# EAGLE board snesram (EAGLE 5.06), part 1 of 2
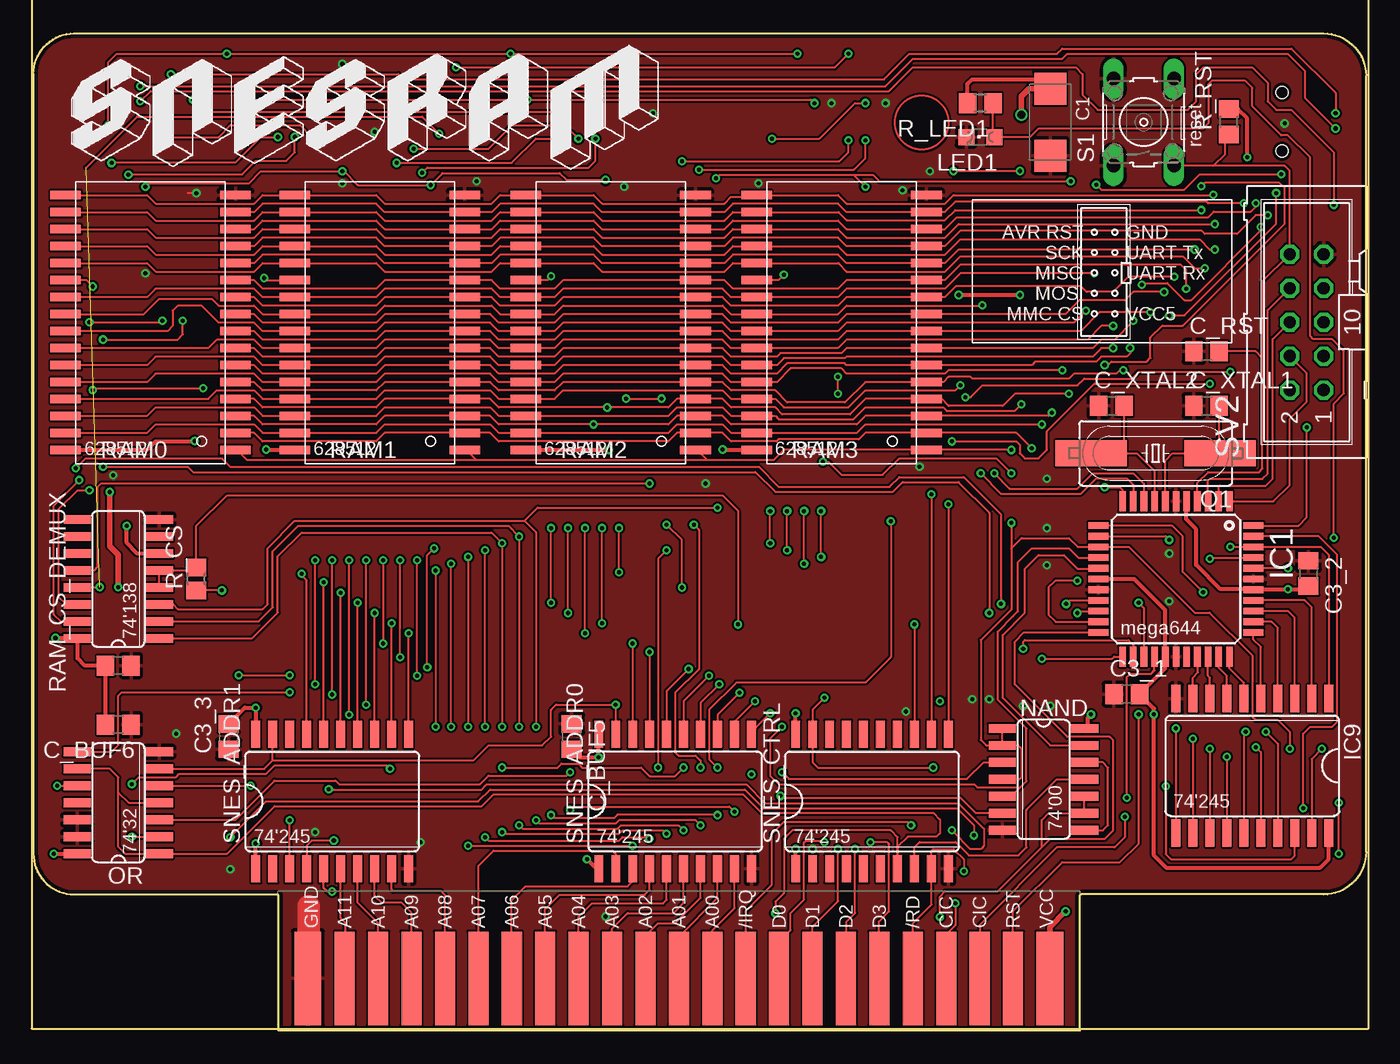
[diagram p2: board, top side]
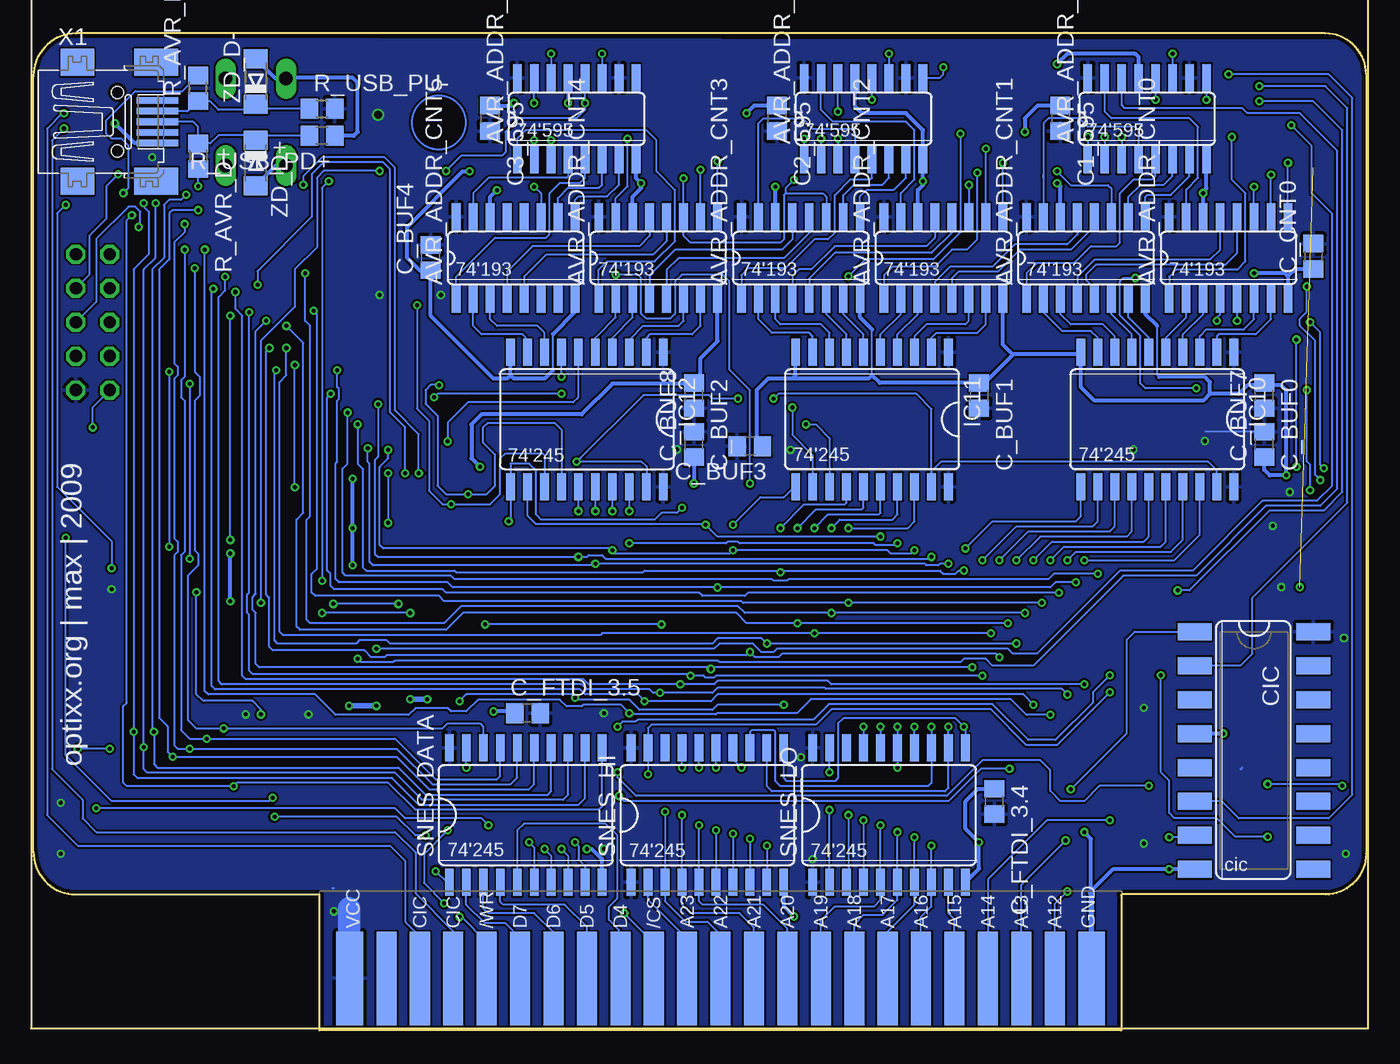
[diagram p3: board, bottom side, seen from below]

Size 99.7 x 74.55 mm. Coordinates in mm from the lower left corner, seen from the top.
Outline: 99.7,71.34 99.7,13.33 arc-90 96.52,10.16 78.36,10.16
Outline: 18.32,10.11 18.32,0 78.3,0 78.3,10.11
Outline: 18.29,10.16 3.05,10.16 arc-90 0,13.21 0,71.5 arc-90 3.05,74.55 96.52,74.55 arc-90 99.7,71.37
Copper layers (1*16): Top 0.035mm / dielectric 1.5mm / Bottom 0.035mm
Design rules "PropagandaPCB": minimum track width 6mil, minimum drill 10mil, track to track 6mil, track to pad 6mil, pad to pad 6mil, via to via 6mil, smd to smd 6mil, copper to edge 10mil, drill to drill 10mil, minimum pad ring 10mil, minimum via ring 6mil, stop-mask expansion 2mil, vias tented up to drill 100mil, thermal gap 10mil
Milling: 4 lines

## Footprints (pad centres in the part's own frame; a part is rotated, then mirrored left to right if it is on the bottom)
SO16 = smd 0.66 x 2.032: 1 -4.445,-3.073; 2 -3.175,-3.073; 3 -1.905,-3.073; 4 -0.635,-3.073; 5 0.635,-3.073; 6 1.905,-3.073; 7 3.175,-3.073; 8 4.445,-3.073; 9 4.445,3.073; 10 3.175,3.073; 11 1.905,3.073; 12 0.635,3.073; 13 -0.635,3.073; 14 -1.905,3.073; 15 -3.175,3.073; 16 -4.445,3.073
SMC_C = smd 2.4 x 2.4: + -2.5,0; - 2.5,0
C0805 = smd 1.3 x 1.5: 1 -0.95,0; 2 0.95,0
DIL16_SMD = smd 1.27 x 2.54: 1 -8.89,-4.445; 2 -6.35,-4.445; 3 -3.81,-4.445; 4 -1.27,-4.445; 5 1.27,-4.445; 6 3.81,-4.445; 7 6.35,-4.445; 8 8.89,-4.445; 9 8.89,4.445; 10 6.35,4.445; 11 3.81,4.445; 12 1.27,4.445; 13 -1.27,4.445; 14 -3.81,4.445; 15 -6.35,4.445; 16 -8.89,4.445
TQFP44 = smd 1.5 x 0.5: 1 -5.8,4; 2 -5.8,3.2; 3 -5.8,2.4; 4 -5.8,1.6; 5 -5.8,0.8; 6 -5.8,0; 7 -5.8,-0.8; 8 -5.8,-1.6; 9 -5.8,-2.4; 10 -5.8,-3.2; 11 -5.8,-4; 23 5.8,-4; 24 5.8,-3.2; 25 5.8,-2.4; 26 5.8,-1.6; 27 5.8,-0.8; 28 5.8,0; 29 5.8,0.8; 30 5.8,1.6; 31 5.8,2.4; 32 5.8,3.2; 33 5.8,4 | smd 0.5 x 1.5: 12 -4,-5.8; 13 -3.2,-5.8; 14 -2.4,-5.8; 15 -1.6,-5.8; 16 -0.8,-5.8; 17 0,-5.8; 18 0.8,-5.8; 19 1.6,-5.8; 20 2.4,-5.8; 21 3.2,-5.8; 22 4,-5.8; 34 4,5.8; 35 3.2,5.8; 36 2.4,5.8; 37 1.6,5.8; 38 0.8,5.8; 39 0,5.8; 40 -0.8,5.8; 41 -1.6,5.8; 42 -2.4,5.8; 43 -3.2,5.8; 44 -4,5.8
SO20W = smd 0.66 x 2.032: 1 -5.715,-5.029; 2 -4.445,-5.029; 3 -3.175,-5.029; 4 -1.905,-5.029; 5 -0.635,-5.029; 6 0.635,-5.029; 7 1.905,-5.029; 8 3.175,-5.029; 9 4.445,-5.029; 10 5.715,-5.029; 11 5.715,5.029; 12 4.445,5.029; 13 3.175,5.029; 14 1.905,5.029; 15 0.635,5.029; 16 -0.635,5.029; 17 -1.905,5.029; 18 -3.175,5.029; 19 -4.445,5.029; 20 -5.715,5.029
CHIPLED_0805 = smd 1.2 x 1.2: A 0,-1.05; C 0,1.05
SO14 = smd 0.66 x 2.032: 1 -3.81,-3.073; 2 -2.54,-3.073; 3 -1.27,-3.073; 4 0,-3.073; 5 1.27,-3.073; 6 2.54,-3.073; 7 3.81,-3.073; 8 3.81,3.073; 9 2.54,3.073; 10 1.27,3.073; 11 0,3.073; 12 -1.27,3.073; 13 -2.54,3.073; 14 -3.81,3.073
HC49UP = smd 5.334 x 1.93: 1 -4.826,0; 2 4.826,0
R0805 = smd 1.3 x 1.5: 1 -0.95,0; 2 0.95,0
R0805' = smd 1.3 x 1.5: 1 -0.85,0; 2 0.85,0
MEMORY-SAMSUNG-2_SOP-32 = smd 0.635 x 2.286: 1 -9.525,-6.35; 2 -8.255,-6.35; 3 -6.985,-6.35; 4 -5.715,-6.35; 5 -4.445,-6.35; 6 -3.175,-6.35; 7 -1.905,-6.35; 8 -0.635,-6.35; 9 0.635,-6.35; 10 1.905,-6.35; 11 3.175,-6.35; 12 4.445,-6.35; 13 5.715,-6.35; 14 6.985,-6.35; 15 8.255,-6.35; 16 9.525,-6.35; 17 9.525,6.35; 18 8.255,6.35; 19 6.985,6.35; 20 5.715,6.35; 21 4.445,6.35; 22 3.175,6.35; 23 1.905,6.35; 24 0.635,6.35; 25 -0.635,6.35; 26 -1.905,6.35; 27 -3.175,6.35; 28 -4.445,6.35; 29 -5.715,6.35; 30 -6.985,6.35; 31 -8.255,6.35; 32 -9.525,6.35
B3F-10XX = drill 1.016 long: 1 -3.251,2.261; 2 3.251,2.261; 3 -3.251,-2.261; 4 3.251,-2.261
ML10 = drill 0.914 octagon: 1 -5.08,-1.27; 2 -5.08,1.27; 3 -2.54,-1.27; 4 -2.54,1.27; 5 0,-1.27; 6 0,1.27; 7 2.54,-1.27; 8 2.54,1.27; 9 5.08,-1.27; 10 5.08,1.27
SNES_CON = smd 2 x 7: 5 2.25,3.5; 27 57.75,3.5 | smd 1.5 x 7: 6 5,3.5; 7 7.5,3.5; 8 10,3.5; 9 12.5,3.5; 10 15,3.5; 11 17.5,3.5; 12 20,3.5; 13 22.5,3.5; 14 25,3.5; 15 27.5,3.5; 16 30,3.5; 17 32.5,3.5; 18 35,3.5; 19 37.5,3.5; 20 40,3.5; 21 42.5,3.5; 22 45,3.5; 23 47.5,3.5; 24 50,3.5; 25 52.5,3.5; 26 55,3.5 | smd 2 x 7 bottom: 36 2.25,3.5; 58 57.75,3.5 | smd 1.5 x 7 bottom: 37 5,3.5; 38 7.5,3.5; 39 10,3.5; 40 12.5,3.5; 41 15,3.5; 42 17.5,3.5; 43 20,3.5; 44 22.5,3.5; 45 25,3.5; 46 27.5,3.5; 47 30,3.5; 48 32.5,3.5; 49 35,3.5; 50 37.5,3.5; 51 40,3.5; 52 42.5,3.5; 53 45,3.5; 54 47.5,3.5; 55 50,3.5; 56 52.5,3.5; 57 55,3.5
CON-CYPRESSINDUSTRIES_32005-201 = smd 0.5 x 3.1: 1 1.6,-9.027; 2 0.8,-9.027; 3 0,-9.027; 4 -0.8,-9.027; 5 -1.6,-9.027 | smd 2 x 2.5: M1 -4.45,-3.027; M2 4.45,-3.027 | smd 2 x 3.3: M3 4.45,-8.928; M4 -4.45,-8.928 | hole 0.9: 2.2,-6.027; -2.2,-6.027
MINIMELF = smd 1.4 x 1.8: A 1.7,0; C -1.7,0

## Placement (x,y rotation side)
AVR_ADDR_CNT0  40193D  [SO16]  10.29,57.77 0 bottom
AVR_ADDR_CNT1  40193D  [SO16]  20.96,57.75 0 bottom
AVR_ADDR_CNT2  40193D  [SO16]  31.62,57.75 0 bottom
AVR_ADDR_CNT3  40193D  [SO16]  42.29,57.75 0 bottom
AVR_ADDR_CNT4  40193D  [SO16]  52.96,57.75 0 bottom
AVR_ADDR_CNT5  40193D  [SO16]  63.63,57.75 0 bottom
AVR_ADDR_SREG0  74HCT595D  [SO16]  16.38,68.17 0 bottom
AVR_ADDR_SREG1  74HCT595D  [SO16]  37.59,68.17 0 bottom
AVR_ADDR_SREG2  74HCT595D  [SO16]  59.05,68.17 0 bottom
C1  [SMC_C]  76.07,67.91 270 top
C1_595  100n  [C0805]  22.86,68.2 270 bottom
C2_595  100n  [C0805]  44.07,68.2 270 bottom
C3_1  100n  [C0805]  81.79,25.15 0 top
C3_2  100n  [C0805]  95.38,34.16 270 top
C3_3  100n  [C0805]  14.6,21.97 90 top
C3_595  100n  [C0805]  65.53,68.2 270 bottom
C_BUF0  100n  [C0805]  7.62,47.47 270 bottom
C_BUF1  100n  [C0805]  28.96,47.47 270 bottom
C_BUF2  100n  [C0805]  50.29,47.47 270 bottom
C_BUF3  100n  [C0805]  46.1,43.69 180 bottom
C_BUF4  100n  [C0805]  69.98,57.78 90 bottom
C_BUF5  100n  [C0805]  40.26,21.97 270 top
C_BUF6  100n  [C0805]  6.35,22.86 180 top
C_BUF7  100n  [C0805]  7.62,43.81 90 bottom
C_BUF8  100n  [C0805]  50.29,43.81 90 bottom
C_CNT0  100n  [C0805]  3.94,57.88 90 bottom
C_DEMUX  100n  [C0805]  6.35,27.27 180 top
C_FTDI_3.4  100n  [C0805]  27.81,17.11 270 bottom
C_FTDI_3.5  100n  [C0805]  62.74,23.72 0 bottom
C_RST  47n  [C0805]  87.76,50.77 0 top
C_XTAL1  22p  [C0805]  87.76,46.7 0 top
C_XTAL2  22p  [C0805]  80.65,46.7 0 top
CIC  DIL16_SMD  [DIL16_SMD]  8.38,20.92 270 bottom
IC1  ATMEGA644A  [TQFP44]  85.47,33.75 270 top
IC9  74LS245DW  [SO20W]  91.19,19.78 180 top
IC10  74LS245DW  [SO20W]  15.62,45.69 180 bottom
IC11  74LS245DW  [SO20W]  36.96,45.69 180 bottom
IC12  74LS245DW  [SO20W]  58.29,45.69 180 bottom
LED1  2-4mA  [CHIPLED_0805]  70.83,66.8 90 top
NAND  74S00D  [SO14]  75.56,18.76 270 top
OR  74HC32D  [SO14]  6.35,17.02 90 top
Q1  20MHz  [HC49UP]  83.95,43.15 180 top
R_AVR_D+  68  [R0805]  87.38,65.37 270 bottom
R_AVR_D-  68  [R0805]  87.38,70.45 90 bottom
R_CS  200  [R0805']  12.19,33.75 90 top
R_LED1  1k6  [R0805]  70.83,69.34 180 top
R_RST  4k7  [R0805]  89.44,67.94 90 top
R_USB_PD+  1M  [R0805]  78.11,66.9 180 bottom
R_USB_PU-  1k5  [R0805]  78.11,68.93 0 bottom
RAM0  KM628512-XX  [MEMORY-SAMSUNG-2_SOP-32]  8.76,52.93 90 top
RAM1  KM628512-XX  [MEMORY-SAMSUNG-2_SOP-32]  25.91,52.93 90 top
RAM2  KM628512-XX  [MEMORY-SAMSUNG-2_SOP-32]  43.18,52.93 90 top
RAM3  KM628512-XX  [MEMORY-SAMSUNG-2_SOP-32]  60.45,52.93 90 top
RAM_CS_DEMUX  74LS138D  [SO16]  6.35,33.75 90 top
S1  [B3F-10XX]  83.06,67.91 90 top
SNES_ADDR0  74LS245DW  [SO20W]  48.01,17.11 0 top
SNES_ADDR1  74LS245DW  [SO20W]  22.35,17.11 0 top
SNES_CTRL  74LS245DW  [SO20W]  62.74,17.11 0 top
SNES_DATA  74LS245DW  [SO20W]  62.86,16.1 0 bottom
SNES_HI  74LS245DW  [SO20W]  49.28,16.1 0 bottom
SNES_LO  74LS245DW  [SO20W]  35.69,16.1 0 bottom
SV2  [ML10]  95.25,52.96 90 top
U$3  SNES_CON_FRONT  [SNES_CON]  18.29,0.38 0 top
X1  MINI-USB  [CON-CYPRESSINDUSTRIES_32005-201]  99.44,67.94 90 bottom
ZD_D+  3.6V  [MINIMELF]  83.06,64.86 270 bottom
ZD_D-  3.6V  [MINIMELF]  83.06,70.96 90 bottom

## Tracks (layer width: path | path; a pad name or v marks a point on that pad's centre or on a via)
A0  (via drill 0.3, 0.3 pad 0.61)
  Top 0.152: v86.87,58.39 69.22,58.39 68.2,57.37 RAM3.12 60.83,57.37 60.2,58.01 52.32,58.01 51.69,57.37 RAM2.12 42.54,57.37 41.91,58.01 34.92,58.01 34.29,57.37 RAM1.12 26.29,57.37 25.65,58.01 17.14,58.01 16.51,57.37 RAM0.12 | v23.62,23.59 v23.62,35.15 | SNES_ADDR0.11 53.72,22.32 v55.12,23.72
  Bottom 0.152: v86.87,58.39 86.87,25.37 86.61,25.11 78.61,25.11 77.09,23.59 71.63,23.59 71.12,24.1 68.71,24.1 68.45,23.84 67.31,23.84 66.42,24.73 60.32,24.73 59.82,24.22 58.67,24.22 58.55,24.35 55.75,24.35 v55.12,23.72 55.02,23.62 48.64,23.62 48.55,23.72 42.58,23.72 41.53,24.76 26.58,24.76 25.4,23.59 v23.62,23.59 | IC10.16 14.99,36.54 15.37,36.16 22.61,36.16 v23.62,35.15
A1  (via drill 0.3, 0.3 pad 0.61)
  Top 0.152: v86.23,55.47 86.23,56.86 85.85,57.24 69.34,57.24 68.2,56.1 RAM3.11 60.83,56.1 60.2,55.47 52.32,55.47 51.69,56.1 RAM2.11 39.62,56.1 38.99,55.47 34.92,55.47 34.29,56.1 RAM1.11 26.29,56.1 25.65,55.47 17.14,55.47 16.51,56.1 RAM0.11 | v24.89,24.35 v24.89,35.15 | SNES_ADDR0.12 52.45,23.08 v53.97,24.61
  Bottom 0.152: v86.23,55.47 86.36,55.34 86.36,25.75 86.11,25.49 58.8,25.49 58.42,25.11 54.48,25.11 v53.97,24.61 49.02,24.61 48.51,25.11 25.65,25.11 v24.89,24.35 | IC10.15 16.26,36.92 16.64,36.54 23.5,36.54 v24.89,35.15
A2  (via drill 0.3, 0.3 pad 0.61)
  Top 0.152: v85.34,56.36 81.92,56.36 80.77,55.21 78.77,55.21 78.36,55.63 68.99,55.63 68.2,54.83 RAM3.10 60.83,54.83 60.2,54.2 52.2,54.2 51.56,54.83 RAM2.10 39.62,54.83 38.99,54.2 34.92,54.2 34.29,54.83 RAM1.10 26.29,54.83 25.65,54.2 17.14,54.2 16.51,54.83 RAM0.10 | v22.35,25.11 v22.35,35.15 | SNES_ADDR0.13 51.18,23.59 v52.83,25.24
  Bottom 0.152: v85.34,56.36 85.34,55.34 85.85,54.83 85.85,26.13 85.6,25.88 58.67,25.88 58.29,25.49 53.59,25.49 53.34,25.24 v52.83,25.24 48.89,25.24 48.51,25.62 40.51,25.62 40.42,25.53 22.77,25.53 v22.35,25.11 | IC10.17 13.72,36.67 14.6,35.78 21.72,35.78 v22.35,35.15
A3  (via drill 0.3, 0.3 pad 0.61)
  Top 0.152: v84.58,55.21 82.3,55.21 81.66,54.58 78.23,54.58 77.22,53.56 RAM3.9 60.83,53.56 60.2,52.93 52.2,52.93 51.56,53.56 RAM2.9 39.62,53.56 38.99,52.93 34.8,52.93 34.16,53.56 RAM1.9 26.29,53.56 25.65,52.93 17.14,52.93 16.51,53.56 RAM0.9 | v21.08,25.88 v21.08,35.15 | SNES_ADDR0.14 49.91,24.48 v51.31,25.88
  Bottom 0.152: v84.58,55.21 84.58,53.94 84.07,53.43 84.07,26.51 83.82,26.26 58.55,26.26 58.17,25.88 v51.31,25.88 48.77,25.88 48.51,26.13 40.26,26.13 40,25.88 v21.08,25.88 | v21.08,35.15 14.35,35.15 12.45,37.05 IC10.18
A4  (via drill 0.3, 0.3 pad 0.61)
  Top 0.152: v83.57,53.69 79.76,53.69 78.36,52.29 RAM3.8 60.83,52.29 60.2,51.66 52.2,51.66 51.56,52.29 RAM2.8 39.62,52.29 38.99,51.66 34.8,51.66 34.16,52.29 RAM1.8 26.29,52.29 25.65,51.66 17.14,51.66 16.51,52.29 RAM0.8 | v28.7,26.51 v28.7,35.15 | 50.42,26.51 v50.55,26.51 48.64,24.61 SNES_ADDR0.15
  Bottom 0.152: 83.57,53.82 v83.57,53.69 83.57,32.73 83.69,32.61 83.69,31.21 83.57,31.08 83.57,26.89 83.31,26.64 50.67,26.64 v50.55,26.51 49.53,26.51 49.4,26.38 48.77,26.38 48.64,26.51 v28.7,26.51 | IC10.12 20.07,38.07 20.45,37.69 26.16,37.69 v28.7,35.15
A5  (via drill 0.3, 0.3 pad 0.61)
  Top 0.152: v82.3,53.05 80.9,51.66 79.88,51.66 79.25,51.02 RAM3.7 60.83,51.02 60.45,50.64 55.88,50.64 55.63,50.39 52.2,50.39 51.56,51.02 RAM2.7 39.62,51.02 38.99,50.39 34.8,50.39 34.16,51.02 RAM1.7 26.29,51.02 25.65,50.39 17.14,50.39 16.51,51.02 RAM0.7 | v29.97,36.04 29.46,35.53 v29.46,27.15 | SNES_ADDR0.16 47.37,25.37 v49.02,27.02
  Bottom 0.152: v29.46,27.15 48.89,27.15 v49.02,27.02 49.02,27.15 82.8,27.15 83.06,27.4 83.06,31.21 83.31,31.46 83.31,32.38 83.06,32.64 83.06,52.29 v82.3,53.05 | IC10.11 21.34,38.45 21.72,38.07 27.94,38.07 v29.97,36.04
A6  (via drill 0.3, 0.3 pad 0.61)
  Top 0.152: v82.04,51.02 82.04,50.64 81.79,50.39 79.88,50.39 79.5,50.01 74.93,50.01 74.68,49.75 RAM3.6 60.83,49.75 60.71,49.88 56.39,49.88 55.63,49.12 52.2,49.12 51.56,49.75 RAM2.6 39.62,49.75 38.99,49.12 34.8,49.12 34.16,49.75 RAM1.6 26.29,49.75 25.65,49.12 17.14,49.12 16.51,49.75 RAM0.6 | v27.43,27.91 v27.43,35.15 | v46.1,28.29 SNES_ADDR0.17
  Bottom 0.152: v82.04,51.02 82.3,50.77 82.3,32.61 82.04,32.35 82.04,28.67 81.79,28.42 74.93,28.42 74.42,27.91 73.41,27.91 73.28,28.03 46.35,28.03 v46.1,28.29 45.72,27.91 43.94,27.91 43.69,28.16 27.69,28.16 v27.43,27.91 | IC10.13 18.8,37.69 19.18,37.31 25.27,37.31 v27.43,35.15
A7  (via drill 0.3, 0.3 pad 0.61)
  Top 0.152: v26.16,35.15 v26.16,28.92 | v81.53,49.37 81.28,49.37 81.03,49.12 77.85,49.12 77.47,48.74 70.23,48.74 70.1,48.86 68.45,48.86 68.07,48.48 RAM3.5 62.23,48.48 60.71,46.96 56.39,46.96 55.5,47.85 52.2,47.85 51.56,48.48 RAM2.5 39.62,48.48 38.99,47.85 34.8,47.85 34.16,48.48 RAM1.5 26.29,48.48 25.65,47.85 17.14,47.85 16.51,48.48 RAM0.5 | v44.83,28.92 SNES_ADDR0.18
  Bottom 0.152: v81.53,49.37 81.66,49.24 81.66,29.18 81.41,28.92 75.56,28.92 75.31,29.18 73.28,29.18 73.03,28.92 48.89,28.92 48.51,29.3 45.21,29.3 v44.83,28.92 v26.16,28.92 | IC10.14 17.53,37.31 17.91,36.92 24.38,36.92 v26.16,35.15
A8  (via drill 0.3, 0.3 pad 0.61)
  Top 0.152: v80.77,51.02 79.88,51.02 79.25,50.39 60.83,50.39 60.71,50.26 56.13,50.26 55.63,49.75 RAM3.27 52.2,49.75 51.56,50.39 39.62,50.39 38.99,49.75 RAM2.27 34.8,49.75 34.16,50.39 26.29,50.39 25.65,49.75 RAM1.27 17.14,49.75 16.51,50.39 9.14,50.39 8.51,49.75 RAM0.27 | v41.27,29.69 v41.27,37.56 | SNES_ADDR1.11 v28.07,29.69
  Bottom 0.152: v80.77,51.02 80.77,48.99 81.28,48.48 81.28,29.81 81.03,29.56 57.28,29.56 57.15,29.69 v41.27,29.69 v28.07,29.69 | IC11.16 36.32,38.7 36.45,38.58 40.26,38.58 v41.27,37.56
A9  (via drill 0.3, 0.3 pad 0.61)
  Top 0.152: v42.54,30.45 v42.54,37.56 | SNES_ADDR1.12 v26.8,30.45 | RAM0.26 13.08,51.02 13.72,51.66 16.51,51.66 17.14,51.02 RAM1.26 25.65,51.02 26.29,51.66 34.16,51.66 34.8,51.02 RAM2.26 38.99,51.02 39.62,51.66 51.56,51.66 52.2,51.02 RAM3.26 60.2,51.02 60.83,51.66 78.87,51.66 79.88,52.67 v80.77,52.67
  Bottom 0.152: v80.77,52.67 79.5,51.4 79.5,38.7 80.01,38.19 80.01,30.19 79.76,29.94 68.83,29.94 67.56,31.21 47.12,31.21 46.35,30.45 v42.54,30.45 v26.8,30.45 | IC11.15 37.59,39.08 37.72,38.96 41.15,38.96 v42.54,37.56
A10  (via drill 0.3, 0.3 pad 0.61)
  Top 0.152: v79.38,56.61 69.34,56.61 68.2,55.47 60.83,55.47 60.2,54.83 RAM3.23 52.2,54.83 51.56,55.47 39.62,55.47 38.99,54.83 RAM2.23 34.92,54.83 34.29,55.47 26.29,55.47 25.65,54.83 RAM1.23 17.14,54.83 16.51,55.47 9.14,55.47 8.51,54.83 RAM0.23 | v40,31.21 v40,37.56 | SNES_ADDR1.13 v25.53,31.21
  Bottom 0.152: v79.38,56.61 79.38,53.05 78.99,52.67 78.99,38.45 79.25,38.19 79.25,30.7 78.99,30.45 68.96,30.45 67.69,31.72 46.99,31.72 46.48,31.21 v40,31.21 v25.53,31.21 | IC11.17 35.05,38.58 35.43,38.19 39.37,38.19 v40,37.56
A11  (via drill 0.3, 0.3 pad 0.61)
  Top 0.152: v78.74,53.82 77.85,52.93 60.83,52.93 60.2,52.29 RAM3.25 52.2,52.29 51.56,52.93 39.62,52.93 38.99,52.29 RAM2.25 34.8,52.29 34.16,52.93 26.29,52.93 25.65,52.29 RAM1.25 17.14,52.29 16.51,52.93 13.84,52.93 12.57,54.2 10.79,54.2 10.41,53.82 10.41,52.67 10.03,52.29 RAM0.25 | v38.73,31.97 v38.73,37.56 | SNES_ADDR1.14 v24.26,31.97
  Bottom 0.152: v78.74,53.82 78.49,53.56 78.49,34.51 78.87,34.13 78.87,32.73 78.61,32.48 69.34,32.48 68.96,32.1 46.74,32.1 46.61,31.97 v38.73,31.97 v24.26,31.97 | v38.73,37.56 34.29,37.56 33.78,38.07 IC11.18
A12  (via drill 0.3, 0.3 pad 0.61)
  Top 0.152: v77.47,47.59 73.41,47.59 72.52,46.7 68.45,46.7 67.95,47.21 RAM3.4 62.23,47.21 61.09,46.07 56.01,46.07 55.5,46.58 52.2,46.58 51.56,47.21 RAM2.4 48.13,47.21 47.5,46.58 v42.93,46.58 34.8,46.58 34.16,47.21 RAM1.4 26.29,47.21 25.65,46.58 17.14,46.58 16.51,47.21 RAM0.4 | SNES_ADDR1.15 v22.99,32.73
  Bottom 0.152: v77.47,47.59 77.72,47.34 77.72,34.38 77.47,34.13 77.47,33.24 77.22,32.99 69.09,32.99 68.83,32.73 49.91,32.73 49.66,32.48 46.48,32.48 46.23,32.73 v22.99,32.73 | v42.93,46.58 42.93,44.54 41.4,43.02 IC11.12
A13  (via drill 0.3, 0.3 pad 0.61)
  Top 0.152: v76.96,49.37 68.45,49.37 68.2,49.12 60.83,49.12 60.45,49.5 56.64,49.5 55.63,48.48 RAM3.28 52.2,48.48 51.56,49.12 39.62,49.12 38.99,48.48 RAM2.28 34.8,48.48 34.16,49.12 26.29,49.12 25.65,48.48 RAM1.28 17.14,48.48 16.51,49.12 9.14,49.12 8.51,48.48 RAM0.28 | v47.37,37.81 48.51,36.67 v48.51,33.11 | SNES_ADDR1.16 v21.72,33.5
  Bottom 0.152: v76.96,49.37 76.96,48.1 76.84,47.97 76.84,47.21 76.96,47.08 76.96,42.51 77.09,42.39 77.09,33.75 76.84,33.5 68.71,33.5 68.33,33.11 v48.51,33.11 23.62,33.11 23.24,33.5 v21.72,33.5 | v47.37,37.81 45.31,39.88 43.56,39.88 42.78,40.66 IC11.11
A14  (via drill 0.3, 0.3 pad 0.61)
  Top 0.152: SNES_ADDR1.17 20.45,33.65 20.07,34.04 v20.07,34.13 | RAM0.3 16.51,45.94 17.14,45.31 25.65,45.31 26.29,45.94 RAM1.3 34.16,45.94 34.8,45.31 v41.91,45.31 47.5,45.31 48.13,45.94 RAM2.3 51.56,45.94 52.2,45.31 61.59,45.31 62.23,45.94 RAM3.3 75.95,45.94 v76.2,46.2
  Bottom 0.152: v76.2,46.2 76.2,42.39 76.58,42 76.58,34.26 76.33,34 68.45,34 68.2,33.75 44.45,33.75 44.32,33.62 43.31,33.62 43.18,33.75 23.75,33.75 23.37,34.13 v20.07,34.13 | IC11.13 40.13,44.29 41.15,45.31 v41.91,45.31
A15  (via drill 0.3, 0.3 pad 0.61)
  Top 0.152: v75.44,45.31 62.23,45.31 61.59,44.67 RAM3.31 52.2,44.67 51.56,45.31 48.13,45.31 47.5,44.67 RAM2.31 34.8,44.67 34.16,45.31 26.29,45.31 25.65,44.67 RAM1.31 17.14,44.67 16.51,45.31 9.14,45.31 8.51,44.67 RAM0.31 | v30.1,34.38 v30.1,22.7 | v43.81,34.26 v43.81,37.56
  Bottom 0.152: v75.44,45.31 75.44,42.39 75.06,42 75.06,34.64 74.8,34.38 68.2,34.38 68.07,34.26 54.1,34.26 53.97,34.38 43.94,34.38 v43.81,34.26 43.69,34.38 31.88,34.38 31.62,34.13 30.73,34.13 30.48,34.38 v30.1,34.38 | IC11.14 38.86,39.46 38.99,39.34 42.04,39.34 v43.81,37.56 | SNES_LO.11 29.97,22.57 v30.1,22.7 30.73,23.34 39.12,23.34 39.5,22.95 39.5,18.89 39.75,18.64 43.31,18.64 43.56,18.89 SNES_HI.11
A16  (via drill 0.3, 0.3 pad 0.61)
  Top 0.152: v74.68,43.53 73.53,44.67 RAM3.2 62.23,44.67 61.75,44.2 55.75,44.2 55.59,44.04 52.2,44.04 51.56,44.67 RAM2.2 48.13,44.67 47.5,44.04 34.8,44.04 34.16,44.67 RAM1.2 26.29,44.67 25.65,44.04 17.14,44.04 16.51,44.67 RAM0.2 | v31.24,22.7 v31.24,34.89 | v57.66,34.89 v57.66,38.83
  Bottom 0.152: v74.68,43.53 74.68,42.51 74.55,42.39 74.55,35.02 74.3,34.77 57.78,34.77 v57.66,34.89 33.02,34.89 32.89,34.77 32,34.77 31.88,34.89 v31.24,34.89 | v57.66,38.83 IC12.16 | v31.24,22.7 SNES_LO.12 31.24,18.13 31.5,17.87 44.45,17.87 44.83,18.26 SNES_HI.12
A17  (via drill 0.3, 0.3 pad 0.61)
  Top 0.152: v73.91,46.83 73.41,46.32 68.33,46.32 68.07,46.58 62.23,46.58 61.34,45.69 55.75,45.69 55.5,45.94 RAM3.30 52.2,45.94 51.56,46.58 48.13,46.58 47.5,45.94 RAM2.30 34.8,45.94 34.16,46.58 26.29,46.58 25.65,45.94 RAM1.30 17.14,45.94 16.51,46.58 9.14,46.58 8.51,45.94 RAM0.30 | v32.51,35.4 v32.51,22.7 | v58.93,35.4 v58.93,38.83
  Bottom 0.152: v73.91,46.83 73.91,42.89 74.17,42.64 74.17,35.65 73.91,35.4 v58.93,35.4 58.29,35.4 58.17,35.53 57.15,35.53 56.9,35.27 32.64,35.27 v32.51,35.4 | v58.93,38.83 IC12.15 | v32.51,22.7 SNES_LO.13 32.51,18.51 32.77,18.26 43.81,18.26 44.2,18.64 44.2,22.32 44.32,22.45 45.97,22.45 46.1,22.32 SNES_HI.13
A18  (via drill 0.3, 0.3 pad 0.61)
  Top 0.152: 50.42,42.64 33.15,42.64 | 33.15,42.64 16,42.64 15.24,43.4 RAM0.1 | 50.42,42.64 55.37,42.64 56.13,43.4 RAM3.1 v73.15,43.4 | 50.42,42.64 49.66,43.4 RAM2.1 | 33.15,42.64 32.38,43.4 RAM1.1 | v33.78,22.7 v33.78,35.91 | v56.39,35.91 v56.39,38.83 | v47.37,35.91 46.74,35.27 v46.74,19.65
  Bottom 0.152: v33.78,35.91 34.04,35.65 35.56,35.65 35.81,35.91 v47.37,35.91 47.62,35.65 56.26,35.65 56.39,35.78 v56.39,35.91 56.52,36.04 73.53,36.04 73.79,36.29 73.79,42.13 73.15,42.77 v73.15,43.4 | v56.39,38.83 IC12.17 | SNES_LO.14 v33.78,22.7 | v46.74,19.65 47.37,20.29 SNES_HI.14
A19  (via drill 0.3, 0.3 pad 0.61)
  Top 0.152: v35.05,22.7 v35.05,36.42 34.26,37.21 20.07,37.21 18.29,35.43 18.29,31.24 16.35,29.3 RAM_CS_DEMUX.1 | v55.12,36.42 v55.12,38.83 | v48.64,19.65 48.01,19.02 46.1,19.02 45.47,19.65 41.05,19.65 40.77,19.94 39.5,19.94 39.21,19.65 v35.05,19.65
  Bottom 0.152: v35.05,36.42 35.18,36.29 36.7,36.29 36.83,36.42 46.86,36.42 46.99,36.54 47.75,36.54 47.88,36.42 v55.12,36.42 | v55.12,38.83 IC12.18 | v35.05,22.7 SNES_LO.15 v35.05,19.65 | v48.64,19.65 SNES_HI.15
A20  (via drill 0.3, 0.3 pad 0.61)
  Top 0.152: v36.32,22.7 v36.32,36.92 35.53,37.72 19.81,37.72 17.91,35.81 17.91,31.62 16.86,30.57 RAM_CS_DEMUX.2 | v49.91,19.65 49.91,20.16 49.53,20.54 48.26,20.54 48.01,20.8 48.01,25.24 49.78,27.02 49.78,37.43 v49.4,37.81
  Bottom 0.152: v36.32,36.92 48.51,36.92 v49.4,37.81 49.43,37.85 62.1,37.85 62.74,38.48 IC12.12 | v36.32,22.7 SNES_LO.16 | v49.91,19.65 SNES_HI.16
A21  (via drill 0.3)
  Top 0.152: v51.18,19.65 50.55,20.29 50.55,23.97 52.58,26 62.23,26 64.14,27.91 v64.14,38.07 | 36.73,38.1 19.56,38.1 17.53,36.07 17.53,31.88 17.14,31.5 10.79,31.5 10.45,31.84 RAM_CS_DEMUX.3 | 36.73,38.1 37.72,39.08 v51.18,39.08 | v37.59,22.7 37.59,37.24 36.73,38.1
  Bottom 0.152: v51.18,39.08 51.56,38.7 52.7,38.7 53.21,38.19 61.72,38.19 62.1,38.58 62.1,41.88 62.61,42.39 64.01,42.39 IC12.11 64.01,38.19 v64.14,38.07 | v37.59,22.7 SNES_LO.17 | v51.18,19.65 SNES_HI.17
AVR/SNES_SW  (via drill 0.3, 0.3 pad 0.3)
  Top 0.152: v93.98,21.05 93.98,22.32 93.09,23.21 91.44,23.21 91.19,23.46 91.19,28.03 87.98,31.24 86.87,31.24 81.96,36.15 IC1.14 78.12,36.15 77.47,36.8 73.91,36.8 73.15,36.04 | v96.39,21.05 95.63,20.29 IC9.19 | 73.15,36.04 73.15,31.46 70.87,29.18 70.87,21.72 71.28,21.3 NAND.2 | v73.15,37.94 73.15,36.04 | v44.32,47.24 v46.99,47.24 | v73.15,41.66 72.04,42.77 64.77,42.77 63.53,41.53 60.45,41.53 59.47,42.51 v59.05,42.51 | NAND.2 NAND.1 | NAND.4 73.76,18.76 73.91,18.92 73.91,21.08 73.66,21.34 72.52,21.34 NAND.2
  Bottom 0.152: v93.98,21.05 v96.39,21.05 | IC10.19 11.18,41.88 11.81,42.51 31.81,42.51 32.51,41.81 32.51,41.27 | 32.51,41.78 32.51,41.88 | 32.51,41.27 IC11.19 | 32.51,41.27 32.51,41.78 | 32.51,41.78 32.51,46.45 33.65,47.59 43.97,47.59 v44.32,47.24 | v59.05,42.51 58.8,42.77 | v73.15,41.66 v73.15,37.94 | v46.99,47.24 48.89,47.24 49.15,47.5 54.07,47.5 v59.05,42.51 | IC12.19 53.85,42.16 54.23,42.54 59.02,42.54 v59.05,42.51
AVR/SNES_SW_INV  (via drill 0.3)
  Top 0.152: SNES_ADDR0.19 v43.56,24.35 39.12,24.35 38.73,23.97 38.73,21.97 38.07,21.3 34.04,21.3 32.92,20.19 17.91,20.19 | v59.18,24.86 58.29,23.97 SNES_CTRL.19 58.29,20.03 58.67,19.65 v67.31,19.65 | OR.6 17.27,19.56 17.91,20.19 | 17.91,20.19 SNES_ADDR1.19
  Bottom 0.152: v67.82,24.61 67.31,25.11 59.44,25.11 v59.18,24.86 59.05,24.73 55.12,24.73 54.36,23.97 48.89,23.97 48.51,24.35 v43.56,24.35 | v67.31,19.65 SNES_DATA.19
AVR_ADDR_DWN  (via drill 0.3)
  Top 0.152: IC1.20 78.25,31.35 v78.11,31.21 | v71.5,31.21 71.5,38.7 69.22,40.99 65.02,40.99 64.29,40.26 55.5,40.26 54.01,41.75 11.94,41.75 11.56,42.13 v5.21,42.13 | v11.18,53.05 11.18,52.04 10.79,51.66 v5.21,51.66
  Bottom 0.152: v11.18,53.05 11.18,53.31 10.92,53.56 AVR_ADDR_CNT0.4 | v5.21,42.13 v5.21,51.66 | v71.5,31.21 v78.11,31.21
AVR_ADDR_LATCH  (via drill 0.3, 0.3 pad 0.3)
  Top 0.152: IC1.25 83.07,31.58 v82.68,31.97 | v15.75,69.6 v36.96,69.6 58.17,69.6 v58.42,69.34 | v68.83,64.26 v73.79,64.26
  Bottom 0.152: AVR_ADDR_SREG2.12 v58.42,69.34 58.42,68.83 59.05,68.2 63.37,68.2 64.39,67.18 64.39,65.66 64.64,65.4 67.69,65.4 v68.83,64.26 | AVR_ADDR_SREG0.12 v15.75,69.6 | v36.96,69.6 AVR_ADDR_SREG1.12 | v82.68,31.97 82.68,51.56 80.14,54.1 80.14,56.9 78.49,58.55 78.49,63.75 77.98,64.26 v73.79,64.26
AVR_ADDR_LOAD  (via drill 0.3)
  Top 0.152: v8.38,63.09 8.64,63.34 16.13,63.34 17.02,64.23 v23.11,64.23 23.24,64.23 24.26,63.21 v29.72,63.21 30.61,64.1 39.37,64.1 39.88,63.59 v42.8,63.59 | 51.05,63.75 v51.05,63.72 51.31,63.98 61.34,63.98 | 61.34,63.98 v62.23,63.09 | IC1.21 76.48,30.55 75.95,31.08 75.95,33.11 76.45,33.62 v78.11,33.62 | v77.6,63.5 63.28,63.5 62.8,63.98 61.34,63.98
  Bottom 0.152: AVR_ADDR_CNT0.11 v8.38,63.09 | v23.11,64.23 22.1,63.21 19.3,63.21 19.05,62.96 AVR_ADDR_CNT1.11 | v29.72,63.21 AVR_ADDR_CNT2.11 | 43.43,62.58 40.64,62.58 40.39,62.32 AVR_ADDR_CNT3.11 | 43.43,62.58 43.56,62.45 43.56,59.15 43.81,58.9 50.55,58.9 51.05,59.4 AVR_ADDR_CNT4.11 v51.05,63.72 | v42.8,63.59 43.43,62.96 43.43,62.58 | v62.23,63.09 61.72,62.58 AVR_ADDR_CNT5.11 | v78.11,33.62 78.11,62.99 v77.6,63.5
AVR_ADDR_SCK  (via drill 0.3, 0.3 pad 0.3)
  Top 0.152: IC1.24 82.27,28.82 81.92,29.18 74.17,29.18 74.04,29.05 v74.04,28.54 | v57.15,73.02 v35.69,73.02 v14.48,73.02 6.22,73.02 5.59,72.39 v5.59,67.69
  Bottom 0.152: v74.04,28.54 48.77,28.54 48.39,28.92 45.85,28.92 45.21,28.29 44.32,28.29 44.07,28.54 26.8,28.54 26.42,28.16 24.64,28.16 18.42,34.38 12.95,34.38 7.75,39.59 3.68,39.59 2.54,40.73 2.54,61.05 4.06,62.58 4.06,66.17 v5.59,67.69 | v14.48,73.02 AVR_ADDR_SREG0.11 | v57.15,73.02 AVR_ADDR_SREG2.11 | v35.69,73.02 AVR_ADDR_SREG1.11
AVR_ADDR_SER  (via drill 0.3)
  Top 0.152: IC1.23 80.86,27.95 80.69,27.78 v75.44,27.78
  Bottom 0.152: v75.44,27.78 75.18,27.53 72.77,27.53 72.64,27.65 48.51,27.65 48.39,27.53 30.35,27.53 30.1,27.78 28.45,27.78 27.94,27.27 24.89,27.27 18.16,34 12.7,34 7.49,39.21 3.43,39.21 2.16,40.48 2.16,65.79 4.95,68.58 8.89,68.58 9.27,68.96 18.03,68.96 18.29,69.21 AVR_ADDR_SREG0.14
AVR_ADDR_UP  (via drill 0.3)
  Top 0.152: IC1.19 77.52,32.15 v77.26,31.89 | v72.39,31.89 72.39,38.58 69.6,41.37 64.77,41.37 64.04,40.64 55.75,40.64 54.26,42.13 14.73,42.13 14.1,42.77 3.91,42.77 v3.17,42.04 | 9.52,52.93 v9.65,53.05 9.56,52.96 v4.19,52.96
  Bottom 0.152: v9.65,53.05 AVR_ADDR_CNT0.5 | v72.39,31.89 v77.26,31.89 | v77.26,31.89 | v3.17,42.04 3.43,42.29 3.43,52.2 v4.19,52.96
AVR_CS/  (via drill 0.3 pad 0.3)
  Top 0.152: IC1.40 91.31,34.51 91.34,34.54 v93.85,34.54 | 12.32,33.27 12.32,33.03 R_CS.1 v14.1,32.89 | v97.28,61.72 97.28,65.66 94.11,68.83 92.96,68.83 92.33,69.47 92.33,70.87 91.19,72.01 87.5,72.01 87,71.5 87,69.47 86.36,68.83 79.63,68.83 78.49,69.98 78.49,71.5 77.98,72.01 65.79,72.01 64.01,70.23 8.76,70.23 v8,69.47
  Bottom 0.152: v93.85,34.54 93.85,36.58 97.92,40.64 97.92,61.09 v97.28,61.72 | v8,69.47 3.94,69.47 1.78,67.31 1.78,40.26 3.17,38.86 7.24,38.86 13.21,32.89 v14.1,32.89
AVR_D0
  Top 0.152: IC1.37 95.1,32.15 95.63,31.62 IC9.2
AVR_D1
  Top 0.152: IC1.36 93.87,31.35 94.36,30.86 IC9.3
AVR_D2
  Top 0.152: IC9.4 93.09,30.1 92.64,30.55 IC1.35
AVR_D3
  Top 0.152: IC1.34 91.27,29.22 91.82,28.67 IC9.5
AVR_D4
  Top 0.152: IC1.33 89.47,27.08 90.55,26 IC9.6
AVR_D5
  Top 0.152: IC1.32 88.67,27.12 89.28,26.51 IC9.7
AVR_D6
  Top 0.152: IC1.31 87.87,26.52 88.01,26.38 IC9.8
AVR_D7
  Top 0.152: IC1.30 87.12,27.9 87.12,26.76 86.74,26.38 IC9.9
AVR_D+
  Bottom 0.152: R_USB_PD+.2 83.06,66.9 ZD_D+.C 83.42,66.93 85.85,66.93 86.46,66.32 R_AVR_D+.1 87.38,67.56 87.76,67.94 X1.3
AVR_D-
  Bottom 0.152: R_USB_PU-.1 83.06,68.93 ZD_D-.C 83.48,68.83 85.85,68.83 86.49,69.47 87.34,69.47 R_AVR_D-.1 88.17,68.71 90.3,68.71 | 90.3,68.71 90.44,68.71 | X1.2 90.33,68.74 90.3,68.71
AVR_RD/  (via drill 0.3)
  Top 0.152: v60.2,47.59 v60.2,48.86 | v69.72,47.34 70.1,47.34 70.99,48.23 78.11,48.23 78.61,48.74 82.17,48.74 82.68,49.24 v89.54,49.24 | v89.54,36.16 89.55,36.15 IC1.42 96.31,36.15 96.9,35.56 IC9.1
  Bottom 0.152: v60.2,47.59 69.47,47.59 v69.72,47.34 | v89.54,49.24 v89.54,36.16 | v60.2,48.86 IC12.7
AVR_SNES_WR_EN
  Top 0.152: IC1.16 79.63,34.51 78.11,34.51 77.09,35.53 75.18,35.53 74.17,34.51 74.17,31.21 72.52,29.56 72.52,24.86 76.07,21.3 NAND.13
AVR_UART_RX  (via drill 0.3)
  Top 0.152: IC1.9 83.07,40.88 82.3,41.66 79.25,41.66 78.11,40.51 73.03,40.51 v71.88,41.66 | v82.93,55.75 83.06,55.88 84.84,55.88 86.11,54.61 86.61,54.61 91.82,59.82 v91.82,60.07
  Bottom 0.152: v82.93,55.75 82.93,56.77 78.87,60.83 78.87,64.01 77.98,64.9 73.53,64.9 73.03,64.39 73.03,46.23 71.88,45.08 v71.88,41.66 | v91.82,60.07 91.69,60.2 91.69,61.21 92.08,61.59 92.58,61.59 95,59.18 95,54.48 SV2.5
AVR_UART_TX  (via drill 0.3)
  Top 0.152: IC1.10 82.27,40.79 81.79,41.27 79.5,41.27 78.36,40.13 72.39,40.13 v70.87,41.66 | v79.5,63.25 79.88,62.86 86.11,62.86 87.25,64.01 v93.34,64.01
  Bottom 0.152: v79.5,63.25 79.5,63.88 78.11,65.28 73.41,65.28 72.64,64.52 72.64,46.35 70.87,44.58 v70.87,41.66 | v93.34,64.01 94.23,63.12 94.23,60.71 95.5,59.44 95.5,56.51 SV2.7
AVR_WR/  (via drill 0.3)
  Top 0.152: v68.71,44.04 73.53,44.04 73.79,43.78 73.79,43.15 74.17,42.77 75.18,42.77 75.82,43.4 75.82,44.8 79.38,48.35 v88.01,48.35 | v88.01,35.27 88.09,35.35 IC1.41
  Bottom 0.152: v68.71,44.04 68.71,45.43 67.18,46.96 59.31,46.96 58.93,47.34 IC12.6 | v88.01,48.35 v88.01,35.27
CS/  (via drill 0.3 pad 0.3)
  Top 0.152: v65.91,30.35 SNES_CTRL.13 | RAM_CS_DEMUX.4 RAM_CS_DEMUX.5 9.42,34.42 12.01,34.42 R_CS.2 12.19,37.72 14.48,40 51.56,40 52.7,38.86 v52.7,30.35
  Bottom 0.152: v52.7,30.35 v65.91,30.35
CS_RAM0  (via drill 0.3)
  Top 0.152: RAM_CS_DEMUX.15 2.03,30.57 1.52,31.08 1.52,39.24 v3.43,41.15 | 2.41,56.13 RAM0.22 3.97,56.1 v4.45,55.63
  Bottom 0.152: v4.45,55.63 4.45,53.72 4.95,53.21 4.95,52.7 3.81,51.56 3.81,41.53 v3.43,41.15
CS_RAM1  (via drill 0.3 pad 0.3)
  Top 0.152: v12.7,48.01 4.57,48.01 v4.45,47.88 | v4.19,40.39 3.3,40.39 1.91,38.99 1.91,32.38 2.45,31.84 RAM_CS_DEMUX.14 | 19.53,56.13 19.53,56.1 RAM1.22 17.43,56.1 v17.27,56.26
  Bottom 0.152: v12.7,48.01 16.51,48.01 16.89,48.39 16.89,51.94 18.42,53.47 18.42,56.01 18.16,56.26 v17.27,56.26 | v4.45,47.88 4.45,42.54 4.19,42.29 v4.19,40.39
CS_RAM2  (via drill 0.3 pad 0.3)  (1 unrouted)
  Top 0.152: v30.35,67.06 29.08,68.33 7.75,68.33 3.94,64.52 | RAM_CS_DEMUX.13 4.92,33.11 v4.95,33.15 | RAM2.22 38.45,56.1 v38.73,56.39
  Bottom 0.152: v38.73,56.39 37.46,57.66 32.38,57.66 30.35,59.69 v30.35,67.06
CS_RAM3  (via drill 0.3 pad 0.3)
  Top 0.152: v46.1,40.89 5.08,40.89 4.83,40.64 4.83,34.67 4.57,34.42 3.25,34.42 | 3.25,34.42 3.17,34.42 | RAM_CS_DEMUX.12 3.25,34.42 | RAM3.22 55.72,56.1 v56.13,56.51
  Bottom 0.152: v46.1,40.89 46.1,47.88 47.62,49.4 47.62,56.01 48.13,56.51 51.18,56.51 51.69,56.01 51.69,53.59 52.07,53.21 53.85,53.21 54.23,53.59 54.23,56.26 54.48,56.51 v56.13,56.51
D0  (via drill 0.3, 0.3 pad 0.3)
  Top 0.152: IC9.18 94.36,13.05 94.11,12.79 85.09,12.79 84.71,13.18 v84.71,18.26 | v92.33,60.96 91.44,60.96 90.04,59.56 87.63,59.56 87.41,59.78 69.34,59.78 68.2,58.64 RAM3.13 60.83,58.64 60.2,59.28 52.32,59.28 51.69,58.64 RAM2.13 42.54,58.64 41.91,59.28 34.92,59.28 34.29,58.64 RAM1.13 26.29,58.64 25.65,59.28 17.14,59.28 16.51,58.64 RAM0.13
  Bottom 0.152: v84.71,18.26 92.71,18.26 92.96,18.51 92.96,24.26 92.71,24.51 92.71,60.58 v92.33,60.96 | v84.71,18.26 84.71,18.29 84.45,18.54 | SNES_DATA.11 57.15,16.73 57.4,16.48 71.12,16.48 73.15,18.51 84.45,18.51 v84.71,18.26
D1  (via drill 0.3, 0.3 pad 0.3)
  Top 0.152: v92.2,22.32 93.09,21.43 IC9.17 | v91.44,61.85 91.44,61.59 91.06,61.21 88.3,61.21 87.88,60.8 69.09,60.8 68.2,59.91 RAM3.14 60.83,59.91 60.2,60.55 52.32,60.55 51.69,59.91 RAM2.14 42.54,59.91 41.91,60.55 34.92,60.55 34.29,59.91 RAM1.14 26.29,59.91 25.65,60.55 17.14,60.55 16.51,59.91 RAM0.14
  Bottom 0.152: SNES_DATA.12 58.42,17.37 58.93,16.86 70.87,16.86 72.9,18.89 91.95,18.89 92.2,19.14 v92.2,22.32 92.2,56.9 91.06,58.04 91.06,61.21 91.44,61.59 v91.44,61.85
D2  (via drill 0.3, 0.3 pad 0.3)
  Top 0.152: v91.44,21.18 91.82,20.8 IC9.16 | v90.55,61.85 87.88,61.85 87.76,61.98 68.96,61.98 68.2,61.21 | 68.2,61.21 68.17,61.18 | RAM0.15 16.51,61.18 17.14,61.82 25.65,61.82 26.29,61.18 RAM1.15 34.29,61.18 34.92,61.82 41.91,61.82 42.54,61.18 RAM2.15 51.69,61.18 52.32,61.82 60.2,61.82 60.83,61.18 RAM3.15 68.2,61.18 68.2,61.21
  Bottom 0.152: SNES_DATA.13 59.69,17.62 60.07,17.24 70.61,17.24 72.64,19.27 91.19,19.27 91.44,19.53 v91.44,21.18 91.44,56.9 90.55,57.78 v90.55,61.85
D3  (via drill 0.3, 0.3 pad 0.3)
  Top 0.152: 53.59,62.32 52.2,62.32 51.69,61.82 42.54,61.82 41.91,62.45 RAM2.17 34.92,62.45 34.29,61.82 26.29,61.82 25.65,62.45 RAM1.17 17.14,62.45 16.51,61.82 9.14,61.82 8.51,62.45 RAM0.17 | 53.59,62.32 53.97,62.32 | IC9.15 90.55,22.19 v90.68,22.32 | v88.27,62.48 88.23,62.45 68.83,62.45 68.2,61.82 60.83,61.82 60.2,62.45 RAM3.17 53.59,62.45 53.59,62.32
  Bottom 0.152: SNES_DATA.14 60.96,17.87 61.21,17.62 70.36,17.62 72.39,19.65 90.42,19.65 90.68,19.91 v90.68,22.32 90.81,22.45 90.81,56.9 89.92,57.78 89.92,61.72 89.54,62.1 88.65,62.1 v88.27,62.48
D4  (via drill 0.3 pad 0.3)
  Top 0.152: v89.28,20.45 IC9.14 | v87.38,61.34 68.96,61.34 68.2,60.58 60.83,60.58 60.23,61.18 RAM3.18 52.32,61.18 51.69,60.55 42.54,60.55 41.91,61.18 RAM2.18 34.92,61.18 34.29,60.55 26.29,60.55 25.65,61.18 RAM1.18 17.14,61.18 16.51,60.55 9.14,60.55 8.51,61.18 RAM0.18
  Bottom 0.152: SNES_DATA.15 62.23,18.41 62.61,18.03 70.1,18.03 72.52,20.45 v89.28,20.45 89.66,20.83 89.66,22.73 90.3,23.37 90.3,56.9 89.54,57.66 89.54,61.09 89.28,61.34 v87.38,61.34
D5  (via drill 0.3, 0.3 pad 0.3)
  Top 0.152: v88.01,21.05 IC9.13 | v88.39,60.29 69.22,60.29 68.2,59.28 60.83,59.28 60.2,59.91 RAM3.19 52.32,59.91 51.69,59.28 42.54,59.28 41.91,59.91 RAM2.19 34.92,59.91 34.29,59.28 26.29,59.28 25.65,59.91 RAM1.19 17.14,59.91 16.51,59.28 9.14,59.28 8.51,59.91 RAM0.19
  Bottom 0.152: SNES_DATA.16 63.5,18.89 64.01,18.38 69.85,18.38 72.52,21.05 v88.01,21.05 88.9,21.05 89.15,21.3 89.15,35.53 88.9,35.78 88.9,36.54 89.15,36.8 89.15,48.74 88.9,48.99 88.9,49.62 89.15,49.88 89.15,58.93 88.39,59.69 v88.39,60.29
D6  (via drill 0.3)
  Top 0.152: v88.39,58.39 88.01,58.39 87.25,59.15 69.34,59.15 68.2,58.01 60.83,58.01 60.2,58.64 RAM3.20 52.32,58.64 51.69,58.01 42.54,58.01 41.91,58.64 RAM2.20 34.92,58.64 34.29,58.01 26.29,58.01 25.65,58.64 RAM1.20 17.14,58.64 16.51,58.01 9.14,58.01 8.51,58.64 RAM0.20 | v86.74,21.81 IC9.12
  Bottom 0.152: v88.39,58.39 88.39,48.86 88.65,48.61 88.65,47.34 88.39,47.08 88.39,35.78 88.65,35.53 88.65,22.45 88.01,21.81 v86.74,21.81 72.64,21.81 69.6,18.76 65.02,18.76 64.77,19.02 SNES_DATA.17
D7  (via drill 0.3)
  Top 0.152: 60.25,57.32 60.83,56.74 68.2,56.74 69.34,57.88 85.98,57.88 86.87,56.99 v87.63,56.99 | 60.25,57.32 60.2,57.37 | v85.47,22.57 IC9.11 | RAM0.21 8.51,57.37 9.14,56.74 16.51,56.74 17.14,57.37 RAM1.21 25.65,57.37 26.29,56.74 34.29,56.74 34.92,57.37 RAM2.21 41.91,57.37 42.54,56.74 51.69,56.74 52.32,57.37 RAM3.21 60.25,57.37 60.25,57.32
  Bottom 0.152: v87.63,56.99 87.63,49.24 87.25,48.86 87.25,47.47 87.63,47.08 87.63,35.91 87.38,35.65 87.38,34.77 88.14,34 88.14,23.21 87.5,22.57 v85.47,22.57 69.09,22.57 68.71,22.95 66.29,22.95 66.04,22.7 SNES_DATA.18
GND  (via drill 0.3, 0.3 pad 0.3)
  Top 0.152: v28.96,14.06 28.96,14.19 | v75.82,34.77 75.95,34.64 | v14.73,12.03 14.73,11.91 | v58.29,13.56 58.29,13.68 | v12.19,62.61 11.56,62.61
  Top 1.676: 20.57,5.08 20.57,9.27
  Bottom 0.152: v28.96,14.06 28.98,14.04 | 36.96,48.99 36.96,52.42 | 26.39,50.54 26.48,50.45 26.44,50.49 26.44,50.54 | 28.51,48.42 C_BUF1.1 | 49.78,48.74 49.97,48.74 C_BUF2.1 50.35,48.35 | IC10.10 21.51,50.54 | 7.37,48.23 7.49,48.35 7.56,48.35 C_BUF0.1 7.81,48.23 | 15.49,48.86 15.62,48.99 15.62,52.67 | AVR_ADDR_CNT0.8 5.84,54.83 | 80.72,71.25 S1.2 | 45.59,43.37 45.59,43.56 45.28,43.56 C_BUF3.1 | C_BUF4.1 70.81,56.83 | 60.83,49.37 60.83,52.07 | 59.18,53.72 AVR_ADDR_CNT5.8
  Bottom 0.305: 20.57,10.38 20.57,14.32 v21.08,14.83 | v75.82,41.24 v75.82,37.56 v75.82,34.77 | v84.96,32.1 v84.96,35.65 | 26.44,50.54 27.18,51.28 AVR_ADDR_CNT2.8 | AVR_ADDR_CNT4.8 48.51,51.53 49.78,50.26 49.78,48.74 | AVR_ADDR_CNT3.8 37.85,53.31 36.96,52.42 | 42.93,48.74 37.21,48.74 36.96,48.99 36.38,48.42 C_BUF1.1 | 42.93,48.74 42.67,48.99 IC11.10 | 60.83,49.37 61.47,48.74 63.75,48.74 64.01,48.99 | 64.01,48.99 64.26,48.74 65.28,48.74 69.98,53.43 C_BUF4.1 | 5.84,56.39 AVR_ADDR_CNT0.8 | C_FTDI_3.4.1 29.02,18.06 29.97,17.11 29.97,15.08 v28.96,14.06 28.96,12.08 SNES_LO.10 | 11.68,47.59 12.19,47.08 20.32,47.08 21.34,48.1 IC10.10 | 11.68,47.59 11.68,48.48 12.06,48.86 15.49,48.86 | AVR_ADDR_CNT0.14 v12.19,62.61 12.19,62.71 11.94,62.96 AVR_ADDR_SREG0.8 | AVR_ADDR_CNT1.14 22.86,63.09 v23.11,63.34 | AVR_ADDR_CNT2.14 33.53,62.83 33.15,63.21 v33.15,63.5 AVR_ADDR_SREG1.8 33.15,67.31 34.42,68.58 37.72,68.58 38.23,69.09 AVR_ADDR_SREG1.13 | AVR_ADDR_CNT3.14 v44.2,63.09 | AVR_ADDR_CNT5.14 65.53,62.32 v65.02,62.83 | v66.29,42.13 66.93,42.77 66.93,45.31 66.17,46.07 58.67,46.07 56.39,48.35 50.35,48.35 | v10.67,22.19 CIC.4 | 26.48,50.45 28.51,48.42 | 21.51,50.54 26.39,50.54 | 64.01,48.99 IC12.10 | 7.37,48.23 6.35,48.23 5.97,47.85 v5.97,41.5 7.21,41.5 7.62,41.91 C_BUF7.1 | 11.68,47.59 9.52,47.59 8.89,48.23 7.81,48.23 | SNES_DATA.10 57.15,12.79 57.91,13.56 v58.29,13.56 | C_FTDI_3.5.1 63.81,23.84 v65.28,23.84 | 15.62,52.67 16.51,53.56 AVR_ADDR_CNT1.8 | ZD_D-.A 81.56,71.16 S1.2 | ZD_D+.A 81.56,64.66 S1.1 | R_USB_PD+.1 75.72,66.9 75.44,67.18 75.44,70.87 75.82,71.25 80.72,71.25 | AVR_ADDR_SREG2.8 54.61,63.72 v54.23,63.34 54.23,62.99 54.86,62.35 AVR_ADDR_CNT4.14
  Bottom 0.305: AVR_ADDR_SREG2.13 v59.69,69.34 | AVR_ADDR_SREG0.13 17.02,72.77 17.27,73.02 22.35,73.02 v23.11,72.26 | 45.59,43.56 45.59,47.88 44.74,48.74 42.93,48.74 | SNES_HI.10 43.56,9.27 v42.8,8.51 | X1.5 92.13,66.34 v93.6,67.82 | C2_595.1 45.79,69.15 v46.35,68.58 | C1_595.1 24.58,69.15 25.53,68.2 v25.53,67.18 | C3_595.1 63.95,69.15 v63.75,69.34 | v67.06,64.23 67.6,64.23 71.76,60.07 71.76,57.78 70.81,56.83 | C_BUF8.1 v50.29,40.89 | 60.83,52.07 59.18,53.72 | 20.7,10.29 18.96,12.03 v14.73,12.03 CIC.8 | 5.84,56.39 6.06,56.61 v8.38,56.61 | C_CNT0.1 5.3,56.93 5.84,56.39
  Bottom 0.406: v70.23,24.76 v71.5,24.76 | v74.04,24.26 v76.07,24.26 | 20.57,10.38 20.54,10.35 U$3.5
  pour Top: 99.7,0.13 99.7,74.14 -3.43,74.14 -3.38,-0.05
HI/LOROM_SW  (via drill 0.3)
  Top 0.152: IC1.15 78.16,35.35 77.47,36.04 74.68,36.04 73.66,35.02 73.66,31.34 73.28,30.96 | 73.28,30.96 72.9,30.57 | 73.28,30.96 72.14,29.81 72.14,24.73 74.3,22.57 74.3,18.64 73.82,18.16 | NAND.5 72.49,17.6 73.25,17.6 73.82,18.16 | v15.37,26.54 v19.18,26.54 | v7.37,14.48 OR.2 | v56.01,22.7 55.12,21.81 55.12,19.05 55.78,18.38 70.39,18.38 70.61,18.16 73.82,18.16
  Bottom 0.152: v56.01,22.7 55.63,23.08 54.64,23.08 54.48,23.24 41.34,23.24 40.2,24.38 27.94,24.38 25.27,21.72 23.24,21.72 20.45,24.51 20.45,25.27 v19.18,26.54 | v15.37,26.54 15.37,19.3 14.73,18.67 14.73,16.26 14.35,15.87 11.18,15.87 9.78,14.48 v7.37,14.48
HI/LOROM_SW_INV  (via drill 0.3)
  Top 0.152: v19.18,25.27 6.6,25.27 6.35,25.02 6.35,21.34 5.84,20.83 OR.8
  Bottom 0.152: v53.72,19.14 SNES_HI.19 53.72,22.61 53.47,22.86 41.15,22.86 40,24 28.07,24 25.4,21.34 23.11,21.34 v19.18,25.27
ISP_MISO
  Top 0.152: IC1.2 88.67,40.63 88.77,40.73 92.2,40.73 92.71,41.24 92.71,51.69 SV2.6
ISP_MOSI
  Top 0.152: IC1.1 92.76,39.55 93.98,40.77 93.98,45.72 95.25,46.99 95.25,49.15 SV2.4
ISP_RST
  Top 0.152: IC1.4 87.07,40.94 87.88,41.75 91.69,41.75 91.95,42 91.95,50.26 | C_RST.2 91.44,50.77 91.95,50.26 | 88.27,64.64 93.6,64.64 93.98,64.26 SV2.10 91.95,56.01 91.95,50.26 | 88.27,64.64 85.34,64.64 S1.3 | 88.27,64.64 89.15,65.53 89.15,66.96 89.41,66.96 R_RST.1
ISP_SCK
  Top 0.152: IC1.3 87.87,41.1 88.01,41.24 91.95,41.24 92.33,41.62 92.33,53.85 SV2.8
LED  (via drill 0.3 pad 0.3)
  Top 0.152: IC1.26 83.87,26.92 83.62,26.67 82.04,26.67 81.79,26.42 v81.79,17.4 | R_LED1.1 71.78,66.9 LED1.A 74.55,66.8 75.18,67.44 87.5,67.44 87.88,67.82 87.88,70.74 88.14,70.99 90.68,70.99 91.19,70.48 91.19,69.09 93.34,66.93 93.85,66.93 95.5,65.28 95.5,51.94 95.76,51.69 97.16,51.69 98.04,50.8 98.04,47.62 97.28,46.86 v97.28,36.83
  Bottom 0.152: v81.79,17.4 82.04,17.14 93.85,17.14 97.28,20.57 v97.28,36.83
MMC_CS  (via drill 0.3 pad 0.3)
  Top 0.152: IC1.44 94.65,37.75 95.25,38.35 v95.25,45.08
  Bottom 0.152: v95.25,45.08 95.25,46.61 SV2.2
N1337  (via drill 0.3)
  Top 0.152: v40.13,19.3 39.88,19.05 34.04,19.05 33.4,18.41 22.86,18.41 22.61,18.67 18.03,18.67 15.11,15.75 OR.3
  Bottom 0.152: v40.13,19.3 SNES_LO.19
N$1
  Bottom 0.152: AVR_ADDR_CNT0.7 7.11,53.18 8.25,52.04 11.05,52.04 11.18,51.91 IC10.2
N$2
  Bottom 0.152: AVR_ADDR_CNT2.3 33.53,53.56 35.05,52.04 IC11.4
N$3
  Bottom 0.152: AVR_ADDR_CNT0.2 13.46,53.31 14.99,51.78 IC10.5
N$4
  Bottom 0.152: AVR_ADDR_CNT0.3 12.19,53.56 13.72,52.04 IC10.4
N$5
  Bottom 0.152: AVR_ADDR_CNT1.7 17.78,53.31 16.26,51.78 IC10.6
N$6
  Bottom 0.152: AVR_ADDR_CNT1.6 19.05,53.56 17.53,52.04 IC10.7
N$7
  Bottom 0.152: AVR_ADDR_CNT1.2 24.13,53.69 22.73,52.29 20.57,52.29 20.07,51.78 IC10.9
N$8
  Bottom 0.152: AVR_ADDR_CNT1.3 22.86,53.56 22.1,52.8 19.69,52.8 18.8,51.91 IC10.8
N$9
  Bottom 0.152: AVR_ADDR_CNT0.12 9.65,58.13 10.54,57.24 20.23,57.24 20.96,56.51 20.96,56.13 20.32,55.5 AVR_ADDR_CNT1.5
N$10
  Bottom 0.152: AVR_ADDR_CNT0.13 10.92,58.39 11.68,57.63 20.32,57.63 21.59,56.36 AVR_ADDR_CNT1.4
N$11  (via drill 0.3 pad 0.3)
  Top 0.152: v39.5,68.71 12.83,68.71 v11.94,69.6
  Bottom 0.152: v39.5,68.71 AVR_ADDR_SREG1.14 | AVR_ADDR_SREG0.9 v11.94,69.6
N$12
  Bottom 0.152: AVR_ADDR_CNT0.15 13.46,62.86 12.57,63.75 12.57,67.56 13.21,68.2 19.05,68.2 19.56,68.71 AVR_ADDR_SREG0.15
N$13  (via drill 0.3 pad 0.3)
  Top 0.152: v10.03,66.8 13.84,66.8 14.73,67.69 19.94,67.69 v20.83,66.8
  Bottom 0.152: v10.03,66.8 10.03,63.59 9.02,62.58 9.02,57.5 9.65,56.86 14.22,56.86 14.73,56.36 AVR_ADDR_CNT0.1 | v20.83,66.8 AVR_ADDR_SREG0.1
N$14  (via drill 0.3, 0.3 pad 0.3)
  Top 0.152: v19.56,66.8 19.56,65.66 18.92,65.02 16.64,65.02 15.62,64.01 7.14,64.01 v7.11,63.98
  Bottom 0.152: AVR_ADDR_CNT0.10 v7.11,63.98 | v19.56,66.8 AVR_ADDR_SREG0.2
N$15  (via drill 0.3, 0.3 pad 0.3)
  Top 0.152: v18.29,66.8 17.02,66.8 15.11,64.9 5.87,64.9 v5.84,64.86
  Bottom 0.152: AVR_ADDR_CNT0.9 v5.84,64.86 | v18.29,66.8 AVR_ADDR_SREG0.3
N$16
  Bottom 0.152: 24.13,63.75 AVR_ADDR_CNT1.15 | 24.13,63.75 24.13,63.98 | AVR_ADDR_SREG0.4 17.02,67.31 17.27,67.56 20.83,67.56 21.46,68.2 23.75,68.2 24.13,67.82 24.13,63.75
N$17
  Bottom 0.152: 15.75,65.25 AVR_ADDR_SREG0.5 15.75,63.88 16,63.63 17.37,63.63 18.42,62.58 18.42,58.9 18.67,58.64 20.57,58.64 21.84,57.37 24.64,57.37 25.4,56.61 AVR_ADDR_CNT1.1
N$18
  Bottom 0.152: 14.48,65.63 AVR_ADDR_SREG0.6 14.48,63.88 15.11,63.25 16.86,63.25 17.78,62.32 AVR_ADDR_CNT1.10
N$19
  Bottom 0.152: 13.21,65.63 AVR_ADDR_SREG0.7 13.21,63.88 14.6,62.48 16.35,62.48 16.51,62.32 AVR_ADDR_CNT1.9
N$20
  Bottom 0.152: AVR_ADDR_SREG1.7 34.42,63.75 35.31,62.86 37.34,62.86 37.85,62.36 AVR_ADDR_CNT3.9
N$21  (via drill 0.3 pad 0.3)
  Top 0.152: v42.04,66.67 42.04,65.02 41.53,64.52 29.46,64.52 v29.08,64.13
  Bottom 0.152: AVR_ADDR_CNT2.1 36.07,56.48 35.43,57.12 32.26,57.12 30.99,58.39 29.85,58.39 29.08,59.15 v29.08,64.13 | v42.04,66.67 AVR_ADDR_SREG1.1
N$22  (via drill 0.3 pad 0.3)
  Top 0.152: v28.45,65.91 34.04,65.91 35.81,67.69 39.75,67.69 v40.77,66.67
  Bottom 0.152: AVR_ADDR_CNT2.10 v28.45,65.91 | v40.77,66.67 AVR_ADDR_SREG1.2
N$23  (via drill 0.3 pad 0.3)
  Top 0.152: v27.18,64.86 35.78,64.86 37.59,66.67 v39.5,66.67
  Bottom 0.152: AVR_ADDR_CNT2.9 v27.18,64.86 | v39.5,66.67 AVR_ADDR_SREG1.3
N$24
  Bottom 0.152: AVR_ADDR_CNT2.5 30.99,56.23 30.48,56.74 27.56,56.74 25.91,58.39 22.1,58.39 20.19,60.29 20.32,60.42 AVR_ADDR_CNT1.12
N$25
  Bottom 0.152: AVR_ADDR_CNT1.13 21.59,59.53 22.35,58.77 26.29,58.77 27.94,57.12 31.12,57.12 32.26,55.97 AVR_ADDR_CNT2.4
N$26
  Bottom 0.152: AVR_ADDR_CNT2.2 34.8,53.56 36.32,52.04 IC11.5
N$27
  Bottom 0.152: AVR_ADDR_CNT2.6 29.72,53.05 29.97,52.8 32.89,52.8 33.78,51.91 IC11.3
N$28
  Bottom 0.152: AVR_ADDR_CNT2.7 28.45,52.8 29.08,52.16 32.13,52.16 32.51,51.78 IC11.2
N$29
  Bottom 0.152: AVR_ADDR_CNT4.3 54.86,53.31 56.39,51.78 IC12.4
N$30
  Bottom 0.152: AVR_ADDR_CNT3.15 45.47,62.2 | 45.47,62.2 45.47,62.58 | AVR_ADDR_SREG1.4 38.23,67.18 38.48,67.44 41.4,67.44 42.16,68.2 45.09,68.2 45.47,67.82 45.47,62.2
N$31
  Bottom 0.152: AVR_ADDR_CNT3.1 46.74,56.48 46.23,56.99 43.43,56.99 41.27,59.15 40.26,59.15 39.75,59.66 39.75,62.45 38.58,63.63 37.08,63.63 36.96,63.75 AVR_ADDR_SREG1.5
N$32
  Bottom 0.152: AVR_ADDR_CNT3.10 39.12,62.45 38.32,63.25 36.2,63.25 35.69,63.75 AVR_ADDR_SREG1.6
N$33
  Bottom 0.152: AVR_ADDR_CNT3.3 44.2,53.18 43.81,52.8 40.77,52.8 40.13,52.16 IC11.8
N$34
  Bottom 0.152: AVR_ADDR_CNT3.2 45.47,53.18 44.45,52.16 41.66,52.16 41.4,51.91 IC11.9
N$35
  Bottom 0.152: AVR_ADDR_CNT3.6 40.39,53.56 38.86,52.04 IC11.7
N$36
  Bottom 0.152: AVR_ADDR_CNT3.7 39.12,53.56 37.59,52.04 IC11.6
N$37
  Bottom 0.152: AVR_ADDR_CNT2.15 34.8,62.61 33.78,63.63 33.78,67.31 34.42,67.94 39.88,67.94 40.77,68.83 AVR_ADDR_SREG1.15
N$38  (via drill 0.3 pad 0.3)
  Top 0.152: v60.96,73.02 59.94,72.01 v31.62,72.01
  Bottom 0.152: v60.96,73.02 AVR_ADDR_SREG2.14 | v31.62,72.01 31.62,71.5 31.88,71.25 AVR_ADDR_SREG1.9
N$39
  Bottom 0.152: AVR_ADDR_CNT2.12 30.99,59.66 32.51,58.13 39.75,58.13 41.66,56.23 AVR_ADDR_CNT3.5
N$40
  Bottom 0.152: AVR_ADDR_CNT2.13 32.26,59.28 32.89,58.64 39.75,58.64 41.5,56.9 42.42,56.9 42.93,56.39 AVR_ADDR_CNT3.4
N$41
  Bottom 0.152: AVR_ADDR_CNT3.12 41.66,59.66 43.56,57.75 51.43,57.75 52.32,56.86 AVR_ADDR_CNT4.5
N$42
  Bottom 0.152: AVR_ADDR_CNT3.13 42.93,59.15 43.69,58.39 51.69,58.39 53.59,56.48 AVR_ADDR_CNT4.4
N$43
  Bottom 0.152: AVR_ADDR_CNT4.2 56.13,53.31 57.66,51.78 IC12.5
N$44
  Bottom 0.152: AVR_ADDR_CNT4.6 51.05,53.05 51.43,52.67 54.1,52.67 55.12,51.66 IC12.3
N$45
  Bottom 0.152: AVR_ADDR_CNT4.7 49.78,52.67 50.42,52.04 53.59,52.04 53.85,51.78 IC12.2
N$46
  Top 0.152: NAND.12 80.01,20.03 80.39,19.65 80.39,15.33 80.01,14.95 NAND.8
N$47
  Bottom 0.152: AVR_ADDR_CNT4.12 52.32,59.02 53.34,58.01 61.34,58.01 62.99,56.36 AVR_ADDR_CNT5.5
N$48
  Bottom 0.152: AVR_ADDR_CNT4.13 53.59,59.4 54.36,58.64 62.36,58.64 64.26,56.74 AVR_ADDR_CNT5.4
N$49
  Bottom 0.152: AVR_ADDR_CNT5.3 65.53,53.18 65.02,52.67 61.98,52.67 61.47,52.16 IC12.8
N$50
  Bottom 0.152: AVR_ADDR_CNT5.2 66.8,52.67 66.17,52.04 63.12,52.04 62.74,51.66 IC12.9
N$51  (via drill 0.3)
  Top 0.152: OR.5 v16.26,18.29 | v56.01,19.3 56.52,18.8 69.85,18.8 71.09,20.03 NAND.3
  Bottom 0.152: v16.26,18.29 19.94,18.29 21.08,17.14 22.86,17.14 23.62,17.91 23.62,19.43 24.38,20.19 28.7,20.19 31.37,17.53 54.61,17.53 56.01,18.92 v56.01,19.3
N$52
  Top 0.152: NAND.11 76.58,18.76 74.3,16.48 74.3,13.68 73.69,13.08 69.98,13.08 68.99,14.06 66.29,14.06 65.91,13.68 SNES_CTRL.8
N$53  (via drill 0.3 pad 0.3)
  Top 0.152: v55.24,66.67 58.8,66.67 61.47,69.34 v62.23,69.34
  Bottom 0.152: 62.23,72.23 AVR_ADDR_SREG2.15 v62.23,69.34 | AVR_ADDR_CNT4.15 56.13,62.23 55.24,63.12 v55.24,66.67
N$54
  Bottom 0.152: AVR_ADDR_CNT4.1 57.4,56.86 56.77,57.5 53.21,57.5 51.69,59.02 51.69,62.83 53.09,64.23 53.09,66.55 53.85,67.31 62.86,67.31 63.5,66.67 AVR_ADDR_SREG2.1
N$55  (via drill 0.3, 0.3 pad 0.3)
  Top 0.152: v49.78,64.36 61.37,64.36 62.23,65.22 v62.23,66.55
  Bottom 0.152: AVR_ADDR_CNT4.10 v49.78,64.36 | v62.23,66.55 AVR_ADDR_SREG2.2
N$56  (via drill 0.3, 0.3 pad 0.3)
  Top 0.152: v48.51,64.99 60.29,64.99 60.96,65.66 v60.96,66.55
  Bottom 0.152: AVR_ADDR_CNT4.9 v48.51,64.99 | v60.96,66.55 AVR_ADDR_SREG2.3
N$57
  Bottom 0.152: AVR_ADDR_CNT5.15 66.8,62.58 65.63,63.75 59.82,63.75 59.69,63.88 AVR_ADDR_SREG2.4
N$58
  Bottom 0.152: AVR_ADDR_CNT5.1 68.07,56.36 65.15,59.28 61.34,59.28 61.09,59.53 61.09,62.58 60.29,63.37 58.8,63.37 58.42,63.75 AVR_ADDR_SREG2.5
N$59
  Bottom 0.152: AVR_ADDR_SREG2.6 57.15,63.25 57.4,62.99 59.69,62.99 60.45,62.23 AVR_ADDR_CNT5.10
N$60
  Bottom 0.152: AVR_ADDR_SREG2.7 55.88,63.25 56.77,62.36 58.93,62.36 59.18,62.1 AVR_ADDR_CNT5.9
N$61  (via drill 0.3, 0.3 pad 0.3)
  Top 0.152: IC1.13 84.68,36.95 v84.96,36.67 | v92.96,62.61 92.96,60.32 86.11,53.47 85,53.47 v84.96,53.43
  Bottom 0.152: v84.96,36.67 v84.96,53.43 | v92.96,62.61 92.58,62.99 92.58,66.17 93.09,66.67 93.85,66.67 94.23,67.06 94.23,68.07 92.08,70.23 88.55,70.23 R_AVR_D-.2
N$62  (via drill 0.3, 0.3 pad 0.3)
  Top 0.152: IC1.11 81.47,40.42 81.28,40.61 v80.14,40.61 | v80.14,49.75 80.39,49.75 80.65,50.01 83.28,50.01 83.57,50.29 83.57,51.82 84.45,52.7 85.98,52.7 93.6,60.32 93.6,62.99 93.22,63.37 87.63,63.37 v87.38,63.12
  Bottom 0.152: v80.14,40.61 v80.14,49.75 | v87.38,63.12 R_AVR_D+.2
N$63
  Top 0.152: IC1.8 83.87,41.83 82.55,43.15 Q1.2 81.59,43.15 C_XTAL2.2
N$64
  Bottom 0.152: AVR_ADDR_CNT0.6 8.38,53.18 9.14,52.42 11.94,52.42 12.45,51.91 IC10.3
N$65  (via drill 0.3)
  Top 0.152: v1.78,18.29 OR.10 | v7.37,18.41 7.87,18.92 10.67,18.92 10.92,19.18 17.4,19.18 18.03,19.81 26.42,19.81 v26.67,19.56 | v55.88,17.53 56.01,17.4 69.34,17.4 70.48,16.26 72.46,16.26 NAND.6
  Bottom 0.152: v1.78,18.29 1.91,18.41 v7.37,18.41 | v26.67,19.56 28.83,19.56 31.24,17.14 55.5,17.14 v55.88,17.53
N$68
  Top 0.152: IC1.7 84.67,42.6 85.22,43.15 Q1.1 88.71,43.21 C_XTAL1.2
OE/  (via drill 0.3, 0.3 pad 0.61)
  Top 0.152: v68.45,39.34 SNES_CTRL.11 | RAM0.24 8.25,53.56 9.4,54.7 13.33,54.7 13.84,54.2 16.51,54.2 17.14,53.56 RAM1.24 25.65,53.56 26.29,54.2 34.29,54.2 34.92,53.56 RAM2.24 38.99,53.56 39.62,54.2 51.56,54.2 52.2,53.56 RAM3.24 60.2,53.56 60.83,54.2 70.96,54.2 v70.99,54.23
  Bottom 0.152: IC12.13 61.47,43.02 61.59,43.15 64.39,43.15 64.77,42.77 64.77,40.1 65.53,39.34 v68.45,39.34 69.09,39.34 70.1,40.35 70.1,45.59 70.99,46.48 v70.99,54.23
SNES_PIN06_A11
  Top 0.152: SNES_ADDR1.6 22.99,8.38 23.37,8 23.37,3.96 U$3.6
SNES_PIN07_A10
  Top 0.152: SNES_ADDR1.7 24.26,9.52 25.78,8 25.78,3.89 U$3.7
SNES_PIN08_A9
  Top 0.152: SNES_ADDR1.8 25.53,10.03 26.04,9.52 27.56,9.52 28.29,8.8 U$3.8
SNES_PIN09_A8
  Top 0.152: SNES_ADDR1.9 26.8,10.54 26.92,10.41 30.48,10.41 30.79,10.11 U$3.9
SNES_PIN10_A7
  Top 0.152: SNES_ADDR0.2 43.56,13.18 43.31,13.43 34.42,13.43 33.29,12.3 U$3.10
SNES_PIN11_A6
  Top 0.152: SNES_ADDR0.3 44.83,11.14 44.45,10.76 36.83,10.76 35.79,9.72 U$3.11
SNES_PIN12_A5
  Top 0.152: SNES_ADDR0.4 46.1,10.51 45.72,10.13 39.37,10.13 38.29,9.05 U$3.12
SNES_PIN13_A4
  Top 0.152: SNES_ADDR0.5 47.37,9.75 47.12,9.49 41.78,9.49 40.79,8.5 U$3.13
SNES_PIN14_A3
  Top 0.152: SNES_ADDR0.6 48.64,9.52 47.88,8.76 44.45,8.76 43.29,7.6 U$3.14
SNES_PIN15_A2
  Top 0.152: 49.91,11.14 SNES_ADDR0.7 49.91,9.91 48.01,8 46.74,8 45.79,7.05 U$3.15
SNES_PIN16_A1
  Top 0.152: SNES_ADDR0.8 51.18,9.91 48.29,7.01 U$3.16
SNES_PIN17_A0
  Top 0.152: SNES_ADDR0.9 52.45,9.14 50.79,7.48 U$3.17
SNES_PIN18_/IRQ  (via drill 0.3)
  Top 0.152: v95,16.6 95,22.19 95.5,22.7 97.16,22.7 97.54,23.08 97.54,35.56 96.15,36.95 IC1.43 | v65.66,15.33 65.41,15.59 56.13,15.59 55.24,14.7 55.24,10.89 53.29,8.93 U$3.18
  Bottom 0.152: v95,16.6 72.64,16.6 71.88,15.84 66.17,15.84 v65.66,15.33
SNES_PIN19_D0  (via drill 0.3)
  Top 0.152: v59.18,14.06 59.05,14.19 57.78,14.19 57.66,14.06 57.66,9.78 56.64,8.76 56.64,7.49 55.88,6.73 55.88,3.97 U$3.19